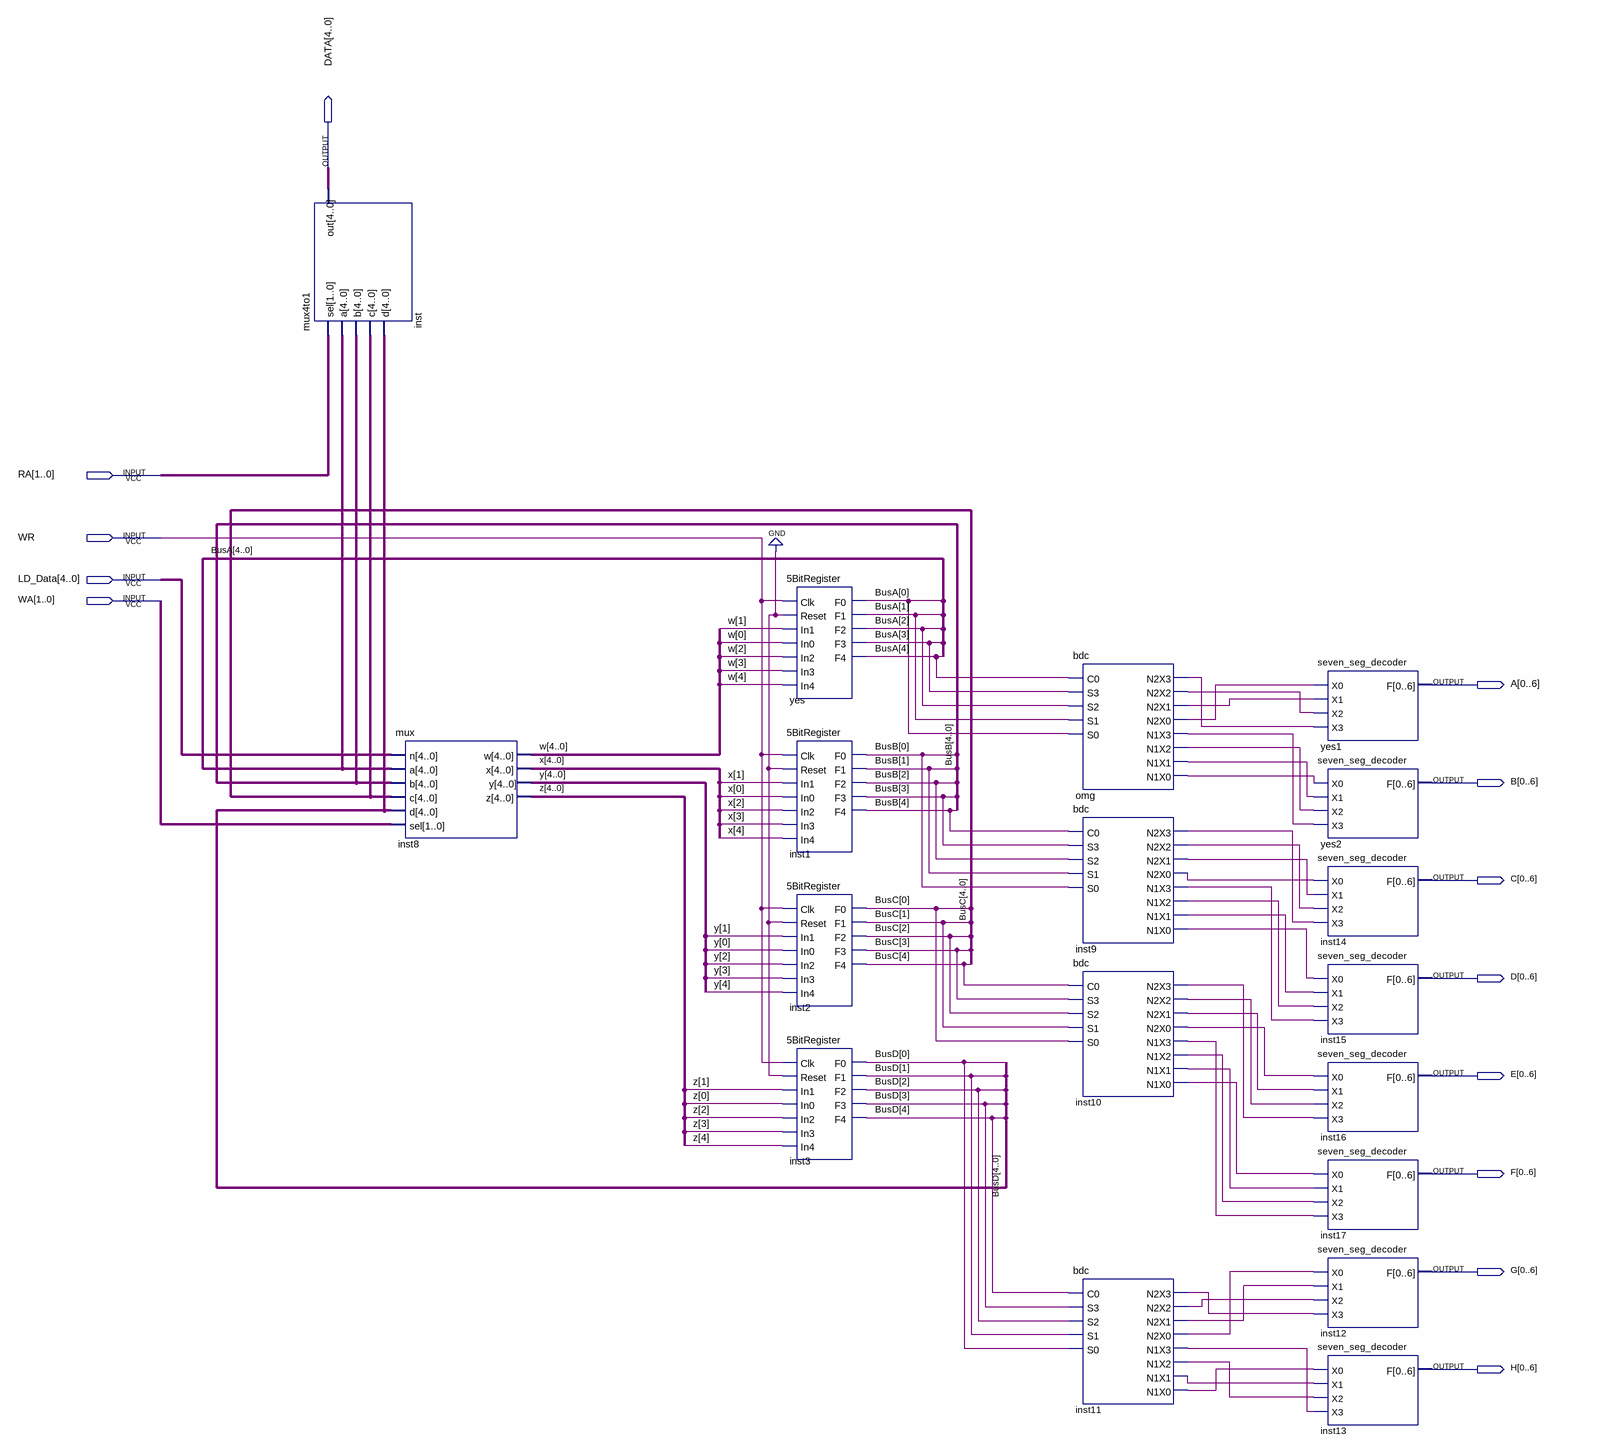
[diagram p0: schematic sheet]
// Quartus schematic RegisterFileV2.bdf as structural Verilog: 18 symbols, 13 pins
module RegisterFileV2 (
  input  [1:0] RA,
  input  WR,
  input  [4:0] LD_Data,
  input  [1:0] WA,
  output [4:0] DATA,
  output [0:6] A,
  output [0:6] B,
  output [0:6] C,
  output [0:6] D,
  output [0:6] E,
  output [0:6] F,
  output [0:6] G,
  output [0:6] H
);

  wire inst9_n1x0, inst9_n1x1, inst9_n1x2, inst9_n1x3, inst9_n2x0, inst9_n2x1, inst9_n2x2, inst9_n2x3,
       inst10_n1x0, inst10_n1x1, inst10_n1x2, inst10_n1x3, inst10_n2x0, inst10_n2x1, inst10_n2x2,
       inst10_n2x3, inst11_n1x0, inst11_n1x1, inst11_n1x2, inst11_n1x3, inst11_n2x0, inst11_n2x1,
       inst11_n2x2, inst11_n2x3, omg_n1x0, omg_n1x1, omg_n1x2, omg_n1x3, omg_n2x0, omg_n2x1, omg_n2x2,
       omg_n2x3;
  wire [4:0] BusA, BusB, BusC, BusD, w, x, y, z;

  mux4to1 inst (.sel(RA), .a(BusA), .b(BusB), .c(BusC), .d(BusD), .out(DATA));
  mux inst8 (.n(LD_Data), .a(BusA), .b(BusB), .c(BusC), .d(BusD), .sel(WA), .w(w), .x(x), .y(y), .z(z));
  \5BitRegister  yes (
    .Clk(WR), .Reset(1'b0), .In1(w[1]), .In0(w[0]), .In2(w[2]), .In3(w[3]), .In4(w[4]), .F0(BusA[0]),
    .F1(BusA[1]), .F2(BusA[2]), .F3(BusA[3]), .F4(BusA[4]));
  \5BitRegister  inst1 (
    .Clk(WR), .Reset(1'b0), .In1(x[1]), .In0(x[0]), .In2(x[2]), .In3(x[3]), .In4(x[4]), .F0(BusB[0]),
    .F1(BusB[1]), .F2(BusB[2]), .F3(BusB[3]), .F4(BusB[4]));
  \5BitRegister  inst2 (
    .Clk(WR), .Reset(1'b0), .In1(y[1]), .In0(y[0]), .In2(y[2]), .In3(y[3]), .In4(y[4]), .F0(BusC[0]),
    .F1(BusC[1]), .F2(BusC[2]), .F3(BusC[3]), .F4(BusC[4]));
  \5BitRegister  inst3 (
    .Clk(WR), .Reset(1'b0), .In1(z[1]), .In0(z[0]), .In2(z[2]), .In3(z[3]), .In4(z[4]), .F0(BusD[0]),
    .F1(BusD[1]), .F2(BusD[2]), .F3(BusD[3]), .F4(BusD[4]));
  bdc omg (
    .C0(BusA[4]), .S3(BusA[3]), .S2(BusA[2]), .S1(BusA[1]), .S0(BusA[0]), .N2X3(omg_n2x3), .N2X2(omg_n2x2),
    .N2X1(omg_n2x1), .N2X0(omg_n2x0), .N1X3(omg_n1x3), .N1X2(omg_n1x2), .N1X1(omg_n1x1), .N1X0(omg_n1x0));
  bdc inst9 (
    .C0(BusB[4]), .S3(BusB[3]), .S2(BusB[2]), .S1(BusB[1]), .S0(BusB[0]), .N2X3(inst9_n2x3),
    .N2X2(inst9_n2x2), .N2X1(inst9_n2x1), .N2X0(inst9_n2x0), .N1X3(inst9_n1x3), .N1X2(inst9_n1x2),
    .N1X1(inst9_n1x1), .N1X0(inst9_n1x0));
  bdc inst10 (
    .C0(BusC[4]), .S3(BusC[3]), .S2(BusC[2]), .S1(BusC[1]), .S0(BusC[0]), .N2X3(inst10_n2x3),
    .N2X2(inst10_n2x2), .N2X1(inst10_n2x1), .N2X0(inst10_n2x0), .N1X3(inst10_n1x3), .N1X2(inst10_n1x2),
    .N1X1(inst10_n1x1), .N1X0(inst10_n1x0));
  bdc inst11 (
    .C0(BusD[4]), .S3(BusD[3]), .S2(BusD[2]), .S1(BusD[1]), .S0(BusD[0]), .N2X3(inst11_n2x3),
    .N2X2(inst11_n2x2), .N2X1(inst11_n2x1), .N2X0(inst11_n2x0), .N1X3(inst11_n1x3), .N1X2(inst11_n1x2),
    .N1X1(inst11_n1x1), .N1X0(inst11_n1x0));
  seven_seg_decoder yes1 (.X0(omg_n2x0), .X1(omg_n2x1), .X2(omg_n2x2), .X3(omg_n2x3), .F(A));
  seven_seg_decoder yes2 (.X0(omg_n1x0), .X1(omg_n1x1), .X2(omg_n1x2), .X3(omg_n1x3), .F(B));
  seven_seg_decoder inst14 (.X0(inst9_n2x0), .X1(inst9_n2x1), .X2(inst9_n2x2), .X3(inst9_n2x3), .F(C));
  seven_seg_decoder inst15 (.X0(inst9_n1x0), .X1(inst9_n1x1), .X2(inst9_n1x2), .X3(inst9_n1x3), .F(D));
  seven_seg_decoder inst16 (.X0(inst10_n2x0), .X1(inst10_n2x1), .X2(inst10_n2x2), .X3(inst10_n2x3), .F(E));
  seven_seg_decoder inst17 (.X0(inst10_n1x0), .X1(inst10_n1x1), .X2(inst10_n1x2), .X3(inst10_n1x3), .F(F));
  seven_seg_decoder inst12 (.X0(inst11_n2x0), .X1(inst11_n2x1), .X2(inst11_n2x2), .X3(inst11_n2x3), .F(G));
  seven_seg_decoder inst13 (.X0(inst11_n1x0), .X1(inst11_n1x1), .X2(inst11_n1x2), .X3(inst11_n1x3), .F(H));
endmodule
